# Altium schematic sheet Input_Digital.SchDoc
size A4
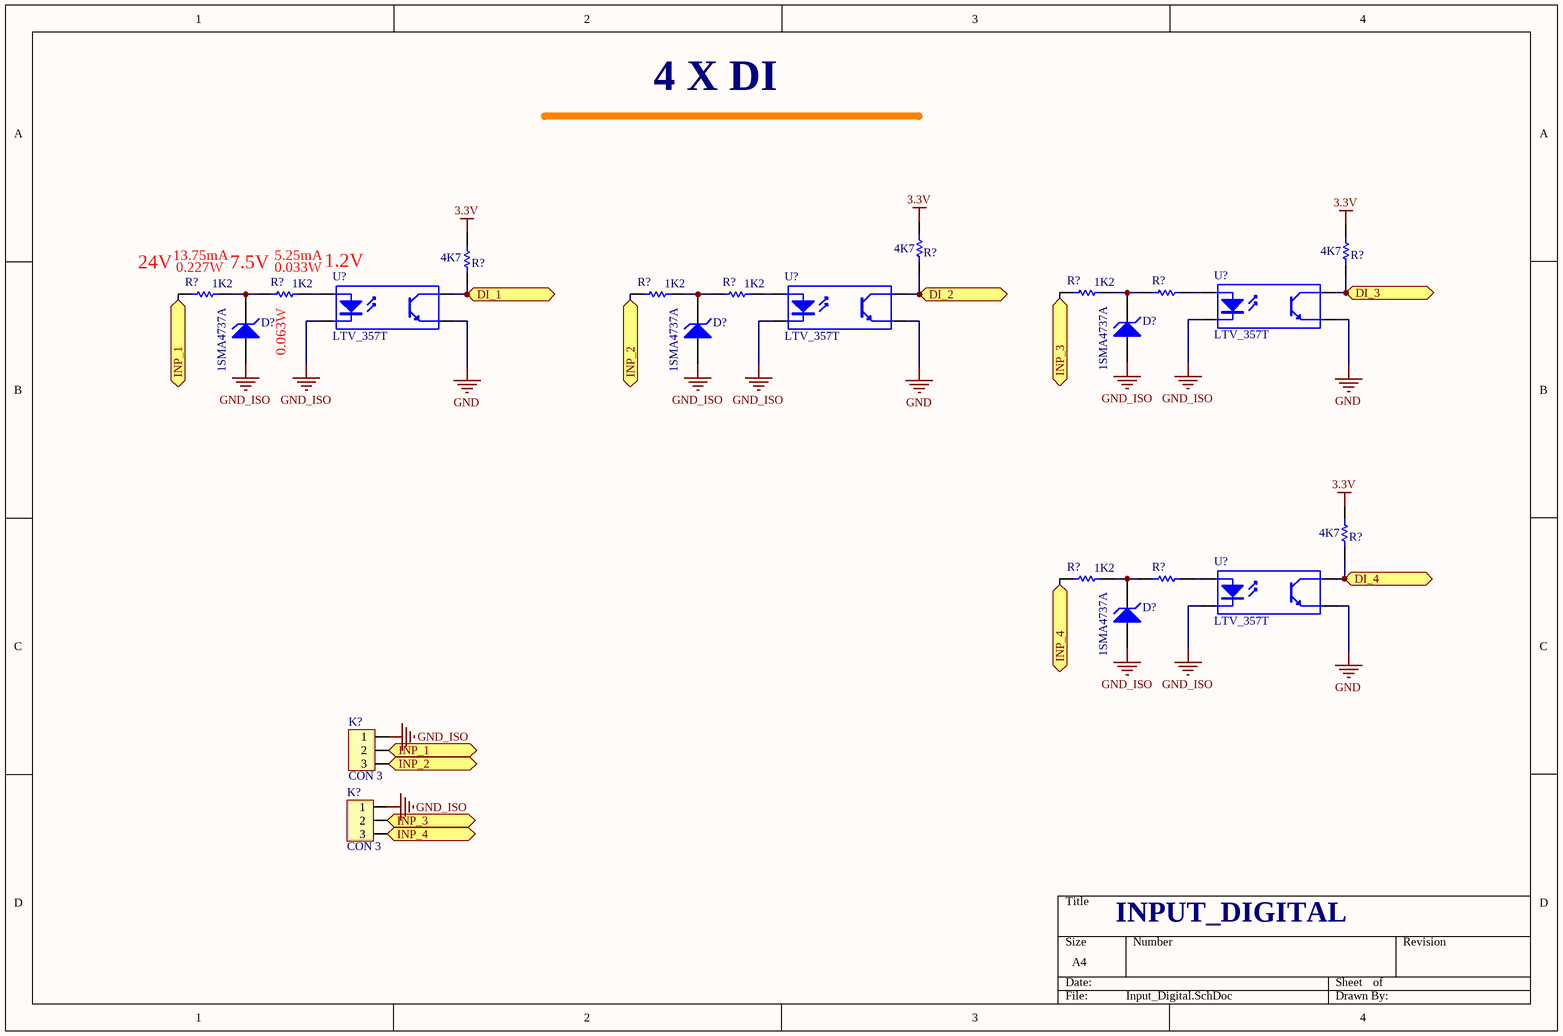
[diagram p0: Input_Digital.SchDoc]

## Parts
(Parts that share a designator on the sheet are numbered #1, #2 ... from top to bottom, then left to right.)
D?#1  1SMA4737A  [DO214AC]
D?#2  1SMA4737A  [DO214AC]
D?#3  1SMA4737A  [DO214AC]
D?#4  1SMA4737A  [DO214AC]
K?#1  CON 3  [CON03P180]
K?#2  CON 3  [CON03P180]
R?#1  4K7  [RES1608[0603]]
R?#2  4K7  [RES1608[0603]]
R?#3  4K7  [RES1608[0603]]
R?#4  1K2  [RES3216[1206]]
R?#5  1K2  [RES2012[0805]]
R?#6  1K2  [RES3216[1206]]
R?#7  1K2  [RES2012[0805]]
R?#8  1K2  [RES3216[1206]]
R?#9  1K2  [RES2012[0805]]  (value not drawn)
R?#10  4K7  [RES1608[0603]]
R?#11  1K2  [RES3216[1206]]
R?#12  1K2  [RES2012[0805]]  (value not drawn)
U?#1  LTV_357T  [SMD-4]
U?#2  LTV_357T  [SMD-4]
U?#3  LTV_357T  [SMD-4]
U?#4  LTV_357T  [SMD-4]

## Ports
DI_1, DI_2, DI_3, DI_4, INP_1, INP_2, INP_3, INP_4

## Nets
3.3V: R?#1.2 R?#2.2 R?#3.2 R?#10.2
GND: U?#1.3(E) U?#2.3(E) U?#3.3(E) U?#4.3(E)
GND_ISO: D?#1.1(A) D?#2.1(A) D?#3.1(A) D?#4.1(A) K?#1.1 K?#2.1 U?#1.2(K) U?#2.2(K) U?#3.2(K) U?#4.2(K)
DI_1: R?#3.1 U?#1.4(C) ; port DI_1
DI_2: R?#1.1 U?#2.4(C) ; port DI_2
DI_3: R?#2.1 U?#3.4(C) ; port DI_3
DI_4: R?#10.1 U?#4.4(C) ; port DI_4
INP_1: K?#1.2 R?#4.2 ; port INP_1
INP_2: K?#1.3 R?#6.2 ; port INP_2
INP_3: K?#2.2 R?#8.2 ; port INP_3
INP_4: K?#2.3 R?#11.2 ; port INP_4
NetD?#1_2: D?#1.2(K) R?#4.1 R?#5.2
NetD?#2_2: D?#2.2(K) R?#6.1 R?#7.2
NetD?#3_2: D?#3.2(K) R?#8.1 R?#9.2
NetD?#4_2: D?#4.2(K) R?#11.1 R?#12.2
NetR?#5_1: R?#5.1 U?#1.1(A)
NetR?#7_1: R?#7.1 U?#2.1(A)
NetR?#9_1: R?#9.1 U?#3.1(A)
NetR?#12_1: R?#12.1 U?#4.1(A)

## Notes on the sheet
- 4 X DI
- (near R?#4) 24V
- (near R?#4) 13.75mA
- (near R?#4) 0.227W
- (near R?#5) 7.5V
- 5.25mA
- 0.033W
- 1.2V
- 0.063W
- INPUT_DIGITAL

## Library data of the parts
D?#1-D?#4 = DIODE: DIODE Zener Diode 7.5V 1W DO214AC; Published: 8-Jun-2000; LatestRevisionDate: 17-Jul-2002; LatestRevisionNote: Re-released for DXP Platform.; PackageReference: DIODE-0.7; Publisher: Altium Limited
K?#1 K?#2 = KLEMENS_3P: Klemens 5.08mm 3lü
R?#1-R?#3 R?#10 = RES: Semiconductor Resistor; Value: 430R; Published: 8-Jun-2000; LatestRevisionDate: 17-Jul-2002; LatestRevisionNote: Re-released for DXP Platform.; PackageReference: AXIAL-0.5; Publisher: Altium Limited
R?#4 R?#6 R?#8 R?#11 = RES: RESISTOR 1206 Case %1; Value: 430R; Published: 8-Jun-2000; LatestRevisionDate: 17-Jul-2002; LatestRevisionNote: Re-released for DXP Platform.; PackageReference: AXIAL-0.5; Publisher: Altium Limited
R?#5 R?#7 R?#9 R?#12 = RES: RESISTOR 0805 Case %1; Value: 430R; Published: 8-Jun-2000; LatestRevisionDate: 17-Jul-2002; LatestRevisionNote: Re-released for DXP Platform.; PackageReference: AXIAL-0.5; Publisher: Altium Limited
U?#1-U?#4 = LVT_357T: OPTOCOUPLER Transistor Output Optocouplers Optocoupler Phototrans; Published: 24-Mar-1999; LatestRevisionDate: 04-Mar-2005; LatestRevisionNote: Sch pins 3 & 4 Swapped.; DatasheetDocument: Nov-2003; PackageReference: DIP-4; Publisher: Altium Limited